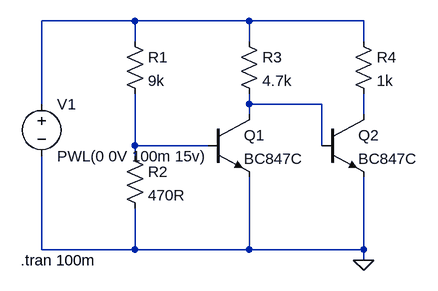
[diagram p0: schematic npn.asc]
npn.asc, the LTspice schematic file:
Version 4.1
SHEET 1 880 680
WIRE 160 -16 16 -16
WIRE 336 -16 160 -16
WIRE 512 -16 336 -16
WIRE 160 16 160 -16
WIRE 336 16 336 -16
WIRE 512 16 512 -16
WIRE 16 112 16 -16
WIRE 336 112 336 96
WIRE 448 112 336 112
WIRE 336 128 336 112
WIRE 512 128 512 96
WIRE 160 176 160 96
WIRE 272 176 160 176
WIRE 448 176 448 112
WIRE 160 192 160 176
WIRE 16 336 16 192
WIRE 160 336 160 272
WIRE 160 336 16 336
WIRE 336 336 336 224
WIRE 336 336 160 336
WIRE 512 336 512 224
WIRE 512 336 336 336
WIRE 512 352 512 336
FLAG 512 352 0
SYMBOL voltage 16 96 R0
WINDOW 123 0 0 Left 0
WINDOW 39 0 0 Left 0
SYMATTR InstName V1
SYMATTR Value PWL(0 0V 100m 15v)
SYMBOL res 144 0 R0
SYMATTR InstName R1
SYMATTR Value 9k
SYMBOL res 144 176 R0
SYMATTR InstName R2
SYMATTR Value 470R
SYMBOL res 320 0 R0
SYMATTR InstName R3
SYMATTR Value 4.7k
SYMBOL res 496 0 R0
SYMATTR InstName R4
SYMATTR Value 1k
SYMBOL npn 272 128 R0
SYMATTR InstName Q1
SYMATTR Value BC847C
SYMBOL npn 448 128 R0
SYMATTR InstName Q2
SYMATTR Value BC847C
TEXT -16 352 Left 2 !.tran 100m

The netlist it stands for:
* npn.asc
V1 N001 0 PWL(0 0V 100m 15v)
R1 N001 N004 9k
R2 N004 0 470R
R3 N001 N002 4.7k
R4 N001 N003 1k
Q1 N002 N004 0 0 BC847C
Q2 N003 N002 0 0 BC847C
.model NPN NPN
.model PNP PNP
.lib standard.bjt
.tran 100m
.backanno
.end